# EAGLE design flame sensor (EAGLE 7.5.0)
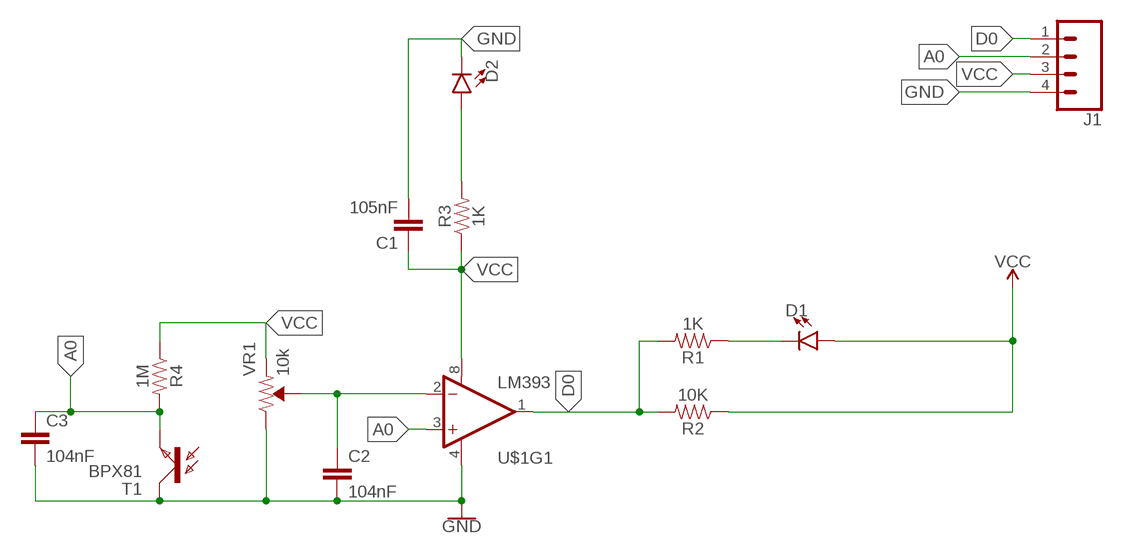
[diagram p0: schematic, sheet 1]

## Parts
C1  105nF  2.2UF-1206-50V-10%  [1206]
C2  104nF  2.2UF-1206-50V-10%  [1206]
C3  104nF  2.2UF-1206-50V-10%  [1206]
D1  LED1206  [LED-1206]
D2  LED1206  [LED-1206]
J1  CONN_04  [1X04]
R1  1K  0.05OHM-0603-1/5W-1%  [0603]
R2  10K  0.05OHM-0603-1/5W-1%  [0603]
R3  1K  0.05OHM-0603-1/5W-1%  [0603]
R4  1M  0.05OHM-0603-1/5W-1%  [0603]
T1  BPX81  [BPX81]
U$1  LM393  [SO08]
VR1  10k  TRIMPOT-SMD-5MM-CLOSED-1/4W-20%  [TRIMPOT-SMD-5MM]

## Nets
A0: C3.1 J1.2 R4.2 T1.E U$1.3(+IN)
D0: J1.1 R1.2 R2.2 U$1.1(OUT)
GND: C1.2 C2.2 C3.2 D2.C J1.4 T1.C U$1.4(V-) VR1.C(CW)
N$1: D1.C R1.1
N$2: C2.1 U$1.2(-IN) VR1.B(WIPER)
N$3: D2.A R3.2
VCC: C1.1 D1.A J1.3 R2.1 R3.1 R4.1 U$1.8(V+) VR1.A(CCW)
Unconnected: U$1.5(+IN) U$1.6(-IN) U$1.7(OUT)

## Library data of the parts
C1-C3 = SparkFun-Capacitors:2.2UF: 2.2µF ceramic capacitors A capacitor is a passive two-terminal electrical component used to store electrical energy temporarily in an electric field.; PROD_ID: CAP-10009; VALUE: 2.2uF
D1 D2 = SparkFun-LED:LED: LED (Generic) Standard schematic elements and footprints for 5mm, 3mm, 1206, and 0603 sized LEDs. Generic LEDs with no color specified.
J1 = SparkFun-Connectors:CONN_04: Multi connection point. Often used as Generic Header-pin footprint for 0.1 inch spaced/style header connections On any of the 0.1 inch spaced packages, you can populate with these: Break Away Headers - Straight <https://www.sparkfun.com/products/116> (PRT-00116) Break Away Male Headers - Right Angle <https://www.sparkfun.com/products/553> (PRT-00553) Female Headers <https://www.sparkfun.com/products/115> (PRT-00115) Break Away Headers - Machine Pin <https://www.sparkfun.com/products/117> (PRT-00117) Break Away Female Headers - Swiss Machine Pin <https://www.sparkfun.com/products/743> (PRT-00743) For SCREWTERMINALS and SPRING TERMINALS visit here: Screw Terimnals on SparkFun.com <https://www.sparkfun.com/search/results?term=Screw+Terminals> (5mm/3.5mm/2.54mm spacing) This device is also useful as a general connection point to wire up your design to another part of your project. Our various solder wires solder well into these plated through hole pads. Hook-Up Wire - Assortment (Stranded, 22 AWG) <https://www.sparkfun.com/products/11375> (PRT-11375) Hook-Up Wire - Assortment (Solid Core, 22 AWG) <https://www.sparkfun.com/products/11367> (PRT-11367) View the entire wire category on our website here <https://www.sparkfun.com/categories/141> Special notes: Molex polarized connector foot print use with SKU : PRT-08231 with associated crimp pins and housings. 1MM SMD Version SKU: PRT-10208; PROD_ID: CONN-09696
R1-R4 = SparkFun-Resistors:0.05OHM: 0.05Ω resistor A resistor is a passive two-terminal electrical component that implements electrical resistance as a circuit element. Resistors act to reduce current flow, and, at the same time, act to lower voltage levels within circuits. - Wikipedia; PROD_ID: RES-12535; VALUE: 0.05
T1 = opto-trans-siemens:BPX81: PHOTO TRANSISTOR; OC_FARNELL: unknown; OC_NEWARK: unknown
U$1 = SparkFun-Retired:LM393: Low-voltage comparator Prototype: IC-09375
VR1 = SparkFun-Resistors:TRIMPOT: Trimming Potentiometer (Trimpot) Three-terminal potentiometers, with an adjustable wiper and two adjustable resistors. A pot can be used to create a configurable voltage divider, or as a variable resistor. "Trimpots" are a subset of potentiometers, usually intended for "set-and-forget" applications. They're often more delicate than standard potentiometers - rated for fewer turns. Variants PTH-KNOB - PTH Trimpot w/ finger-adjustable knob Trimpot 10K with Knob <https://www.sparkfun.com/products/9806> (COM-09806) Datasheet <http://www.sparkfun.com/datasheets/Components/General/TSR-3386.pdf> SMD-3MM-CLOSED-FRAME - SMD 3mm Square Closed-Frame Trimpot Used on e.g. EasyDriver - Stepper Motor Driver <https://www.sparkfun.com/products/12779> Datasheet <http://www.bitechnologies.com/pdfs/22.pdf> (22AR10KTR) SMD-5MM - SMD 5mm Square Closed-Frame Trimpot Used on e.g. IOIO-OTG - V2.2 <https://www.sparkfun.com/products/13613> Datasheet <http://www.vishay.com/docs/51008/ts53.pdf> (TS53YL502MR10) SMD-3MM-1/10W-25% - 3mm Square Open-Frame Trimpot Used on e.g. SparkFun Shapeoko <https://www.sparkfun.com/products/13899> Datasheet <http://www.bourns.com/docs/Product-Datasheets/TC33.pdf> (TC33X-2-103E); PROD_ID: RES-11156; VALUE: 5k

## Board
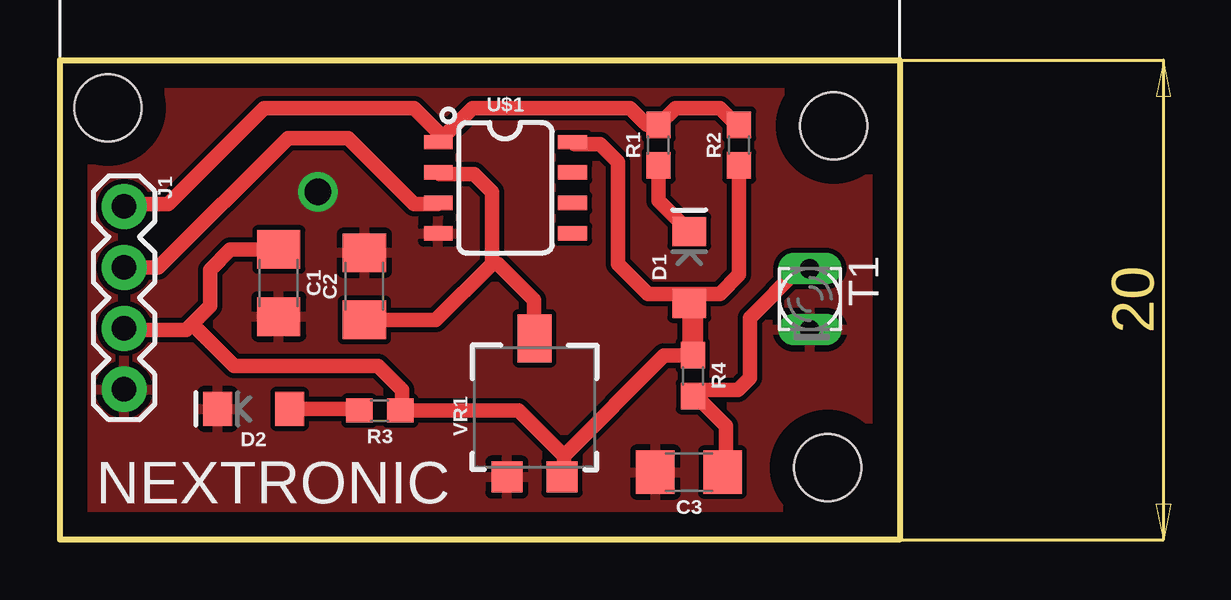
[diagram p1: board, top side]
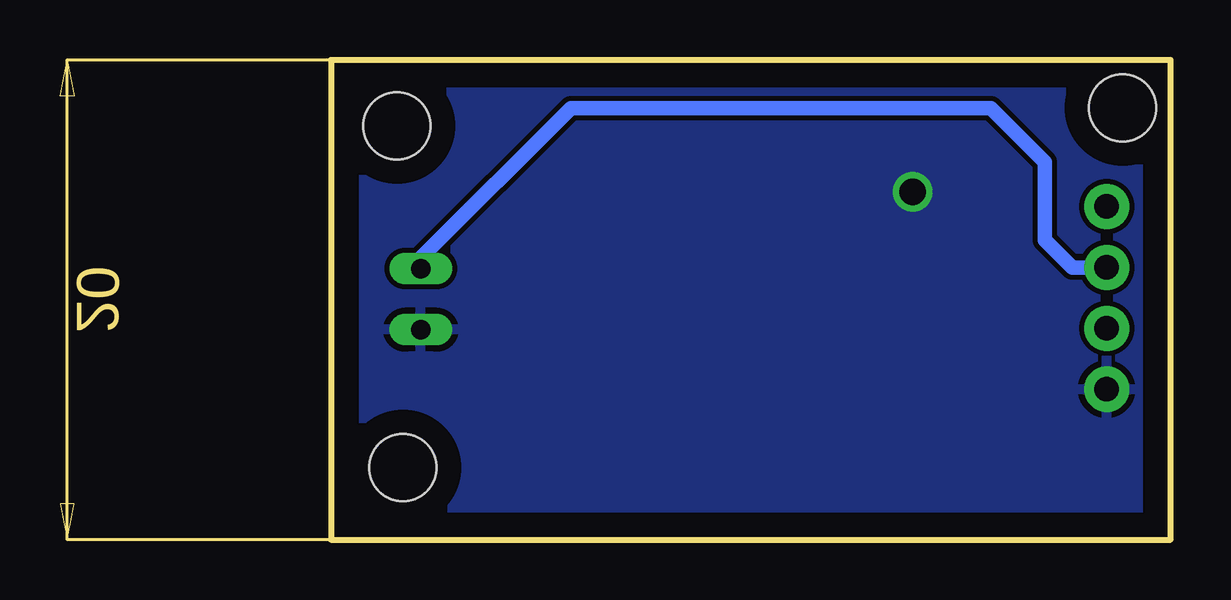
[diagram p2: board, bottom side, seen from below]

Size 35 x 20 mm. Coordinates in mm from the lower left corner, seen from the top.
Outline: 0,20 35,20 35,0 0,0 0,20
Copper layers (1*16): Top 0.035mm / dielectric 1.5mm / Bottom 0.035mm
Design rules "default": minimum track width 10mil, minimum drill 24mil, track to track 8mil, track to pad 8mil, pad to pad 8mil, via to via 8mil, smd to smd 8mil, copper to edge 40mil, drill to drill 8mil, minimum pad ring 10mil, minimum via ring 8mil, stop-mask expansion 4mil, vias tented up to drill 0mil, thermal gap 10mil
Holes 2.8 mm at 32.25,17.25 32,3 2,18

### Footprints (pad centres in the part's own frame; a part is rotated, then mirrored left to right if it is on the bottom)
1206 = smd 1.6 x 1.8: 1 -1.4,0; 2 1.4,0
LED-1206 = smd 1.2 x 1.4: A -1.5,0; C 1.5,0
1X04 = drill 1.016 pad 1.88: 1 0,0; 2 2.54,0; 3 5.08,0; 4 7.62,0
0603 = smd 1.1 x 1: 1 -0.85,0; 2 0.85,0
BPX81 = drill 0.813 long: C 1.27,0; E -1.27,0
SO08 = smd 0.6 x 1.2: 1 -1.905,-2.8; 2 -0.635,-2.8; 3 0.635,-2.8; 4 1.905,-2.8; 5 1.905,2.8; 6 0.635,2.8; 7 -0.635,2.8; 8 -1.905,2.8
TRIMPOT-SMD-5MM = smd 1.3 x 1.3: A 1.15,-2.54; C -1.15,-2.54 | smd 1.402 x 2: B 0,3.239

### Placement (x,y rotation side)
C1  9.12,10.7 270 top
C2  12.69,10.56 90 top
C3  26.22,2.81 180 top
D1  26.23,11.35 90 top
D2  8.07,5.45 180 top
J1  2.67,13.89 270 top
R1  24.95,16.45 90 top
R2  28.31,16.45 90 top
R3  13.33,5.38 180 top
R4  26.38,6.83 270 top
T1  31.26,10.03 270 top
U$1  18.57,14.67 270 top
VR1  19.78,5.15 0 top

### Tracks (layer width: path | path; a pad name or v marks a point on that pad's centre or on a via)
A0
  Top 0.61: C3.1 27.75,2.94 27.75,4.75 26.52,5.98 | 26.52,5.98 R4.2 | 26.52,5.98 26.79,6.25 28.25,6.25 28.75,6.75 28.75,9.25 30.8,11.3 T1.E | U$1.3 15.73,14 14.75,14 12,16.75 9.5,16.75 4.1,11.35 J1.2
  Bottom 0.61: T1.E 31.26,11.74 25,18 7.5,18 5.25,15.75 5.25,12.5 4.1,11.35 J1.2
D0
  Top 0.61: R2.2 28.2,17.3 27.5,18 25.65,18 R1.2 24.45,17.3 23.75,18 17.2,18 U$1.1 15.77,16.98 14.75,18 8.5,18 4.5,14 2.78,14 J1.1
GND  (via drill 1.1)
  other vias: 10.75,14.5
  pour Bottom: 0,20 35,20 35,0 0,0
  pour Top: 0,20 35,20 35,0.25 33,0 0,0
N$1
  Top 0.61: D1.C 24.95,14.13 R1.1
N$2
  Top 0.61: U$1.2 15.82,15.25 17.25,15.25 18,14.5 18,11.5 | 18,11.5 15.66,9.16 C2.1 | VR1.B 19.75,8.42 19.75,10 18.25,11.5 18,11.5
N$3
  Top 0.61: R3.2 12.41,5.45 D2.A
VCC
  Top 0.61: 26.63,10.25 D1.A 26.23,7.83 | 26.63,10.25 27.5,10.25 28.31,11.06 R2.1 | U$1.8 21.45,16.5 22.5,16.5 23.25,15.75 23.25,11.5 24.5,10.25 26.63,10.25 | 26.23,7.83 R4.1 25.18,7.68 21,3.5 | 26.23,7.83 26.5,8.1 26.5,9.75 26.25,9.75 | J1.3 2.73,8.75 5.25,8.75 5.62,9.12 | 5.62,9.12 6.25,9.75 6.25,11.25 7.1,12.1 C1.1 | 5.62,9.12 5.62,8.88 7.25,7.25 13.25,7.25 14.25,6.25 14.25,5.45 R3.1 19.12,5.38 21,3.5 | VR1.A 21,2.68 21,3.5

### Text on the board
tPlace: NEXTRONIC